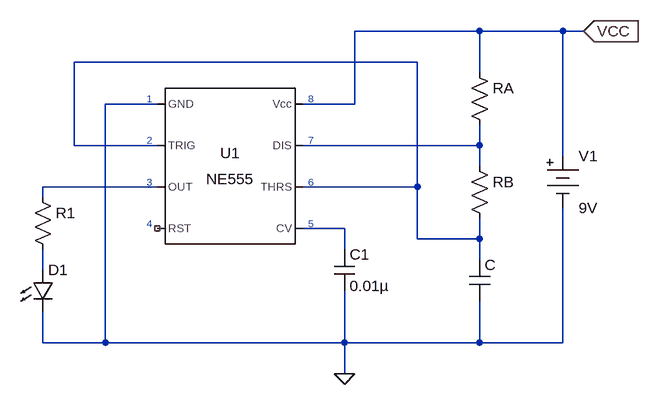
[diagram p0: schematic Blinky Astable.asc]
Blinky Astable.asc, the LTspice schematic file:
Version 4
SHEET 1 924 680
WIRE 592 -32 400 -32
WIRE 720 -32 592 -32
WIRE 752 -32 720 -32
WIRE 496 16 -32 16
WIRE 592 32 592 -32
WIRE 96 80 16 80
WIRE 400 80 400 -32
WIRE 400 80 320 80
WIRE -32 144 -32 16
WIRE 96 144 -32 144
WIRE 592 144 592 112
WIRE 592 144 320 144
WIRE 720 160 720 -32
WIRE 592 176 592 144
WIRE 96 208 -80 208
WIRE 496 208 496 16
WIRE 496 208 320 208
WIRE -80 224 -80 208
WIRE 384 272 320 272
WIRE 496 288 496 208
WIRE 592 288 592 256
WIRE 592 288 496 288
WIRE 384 304 384 272
WIRE 592 320 592 288
WIRE -80 336 -80 304
WIRE -80 448 -80 400
WIRE 16 448 16 80
WIRE 16 448 -80 448
WIRE 384 448 384 368
WIRE 384 448 16 448
WIRE 592 448 592 384
WIRE 592 448 384 448
WIRE 720 448 720 240
WIRE 720 448 592 448
WIRE 384 496 384 448
FLAG 384 496 0
FLAG 752 -32 VCC
IOPIN 752 -32 In
SYMBOL Misc\\NE555 208 176 R0
SYMATTR InstName U1
SYMBOL cap 368 304 R0
SYMATTR InstName C1
SYMATTR Value 0.01µ
SYMATTR SpiceLine V=16 Irms=648m Rser=0.395426 Lser=0 mfg="KEMET" pn="C0402C103K4PAC" type="X5R"
SYMBOL res 576 16 R0
SYMATTR InstName RA
SYMATTR Value ""
SYMBOL cap 576 320 R0
SYMATTR InstName C
SYMATTR Value ""
SYMBOL res -96 208 R0
SYMATTR InstName R1
SYMATTR Value ""
SYMBOL LED -96 336 R0
SYMATTR InstName D1
SYMATTR Value ""
SYMBOL Misc\\battery 720 144 R0
WINDOW 123 0 0 Left 0
WINDOW 39 0 0 Left 0
SYMATTR InstName V1
SYMATTR Value 9V
SYMBOL res 576 160 R0
SYMATTR InstName RB
SYMATTR Value ""
TEXT 80 72 Left 1 ;1
TEXT 80 136 Left 1 ;2
TEXT 80 200 Left 1 ;3
TEXT 80 264 Left 1 ;4
TEXT 328 72 Left 1 ;8
TEXT 328 136 Left 1 ;7
TEXT 328 200 Left 1 ;6
TEXT 328 264 Left 1 ;5

The netlist it stands for:
* Blinky Astable.asc
XU1 0 N001 N003 NC_01 N004 N001 N002 VCC NE555  ; pins GND TRIG OUT RST CV THRS DIS Vcc
C1 N004 0 0.01µ V=16 Irms=648m Rser=0.395426 Lser=0 mfg="KEMET" pn="C0402C103K4PAC" type="X5R"
RA VCC N002
C N001 0
R1 N003 N005
D1 N005 0
V1 VCC 0 9V
RB N002 N001
.model D D
.lib standard.dio
* 1
* 2
* 3
* 4
* 8
* 7
* 6
* 5
.lib NE555.sub
.backanno
.end